# EAGLE design Accelerometer 3-Axis (EAGLE 6.1)
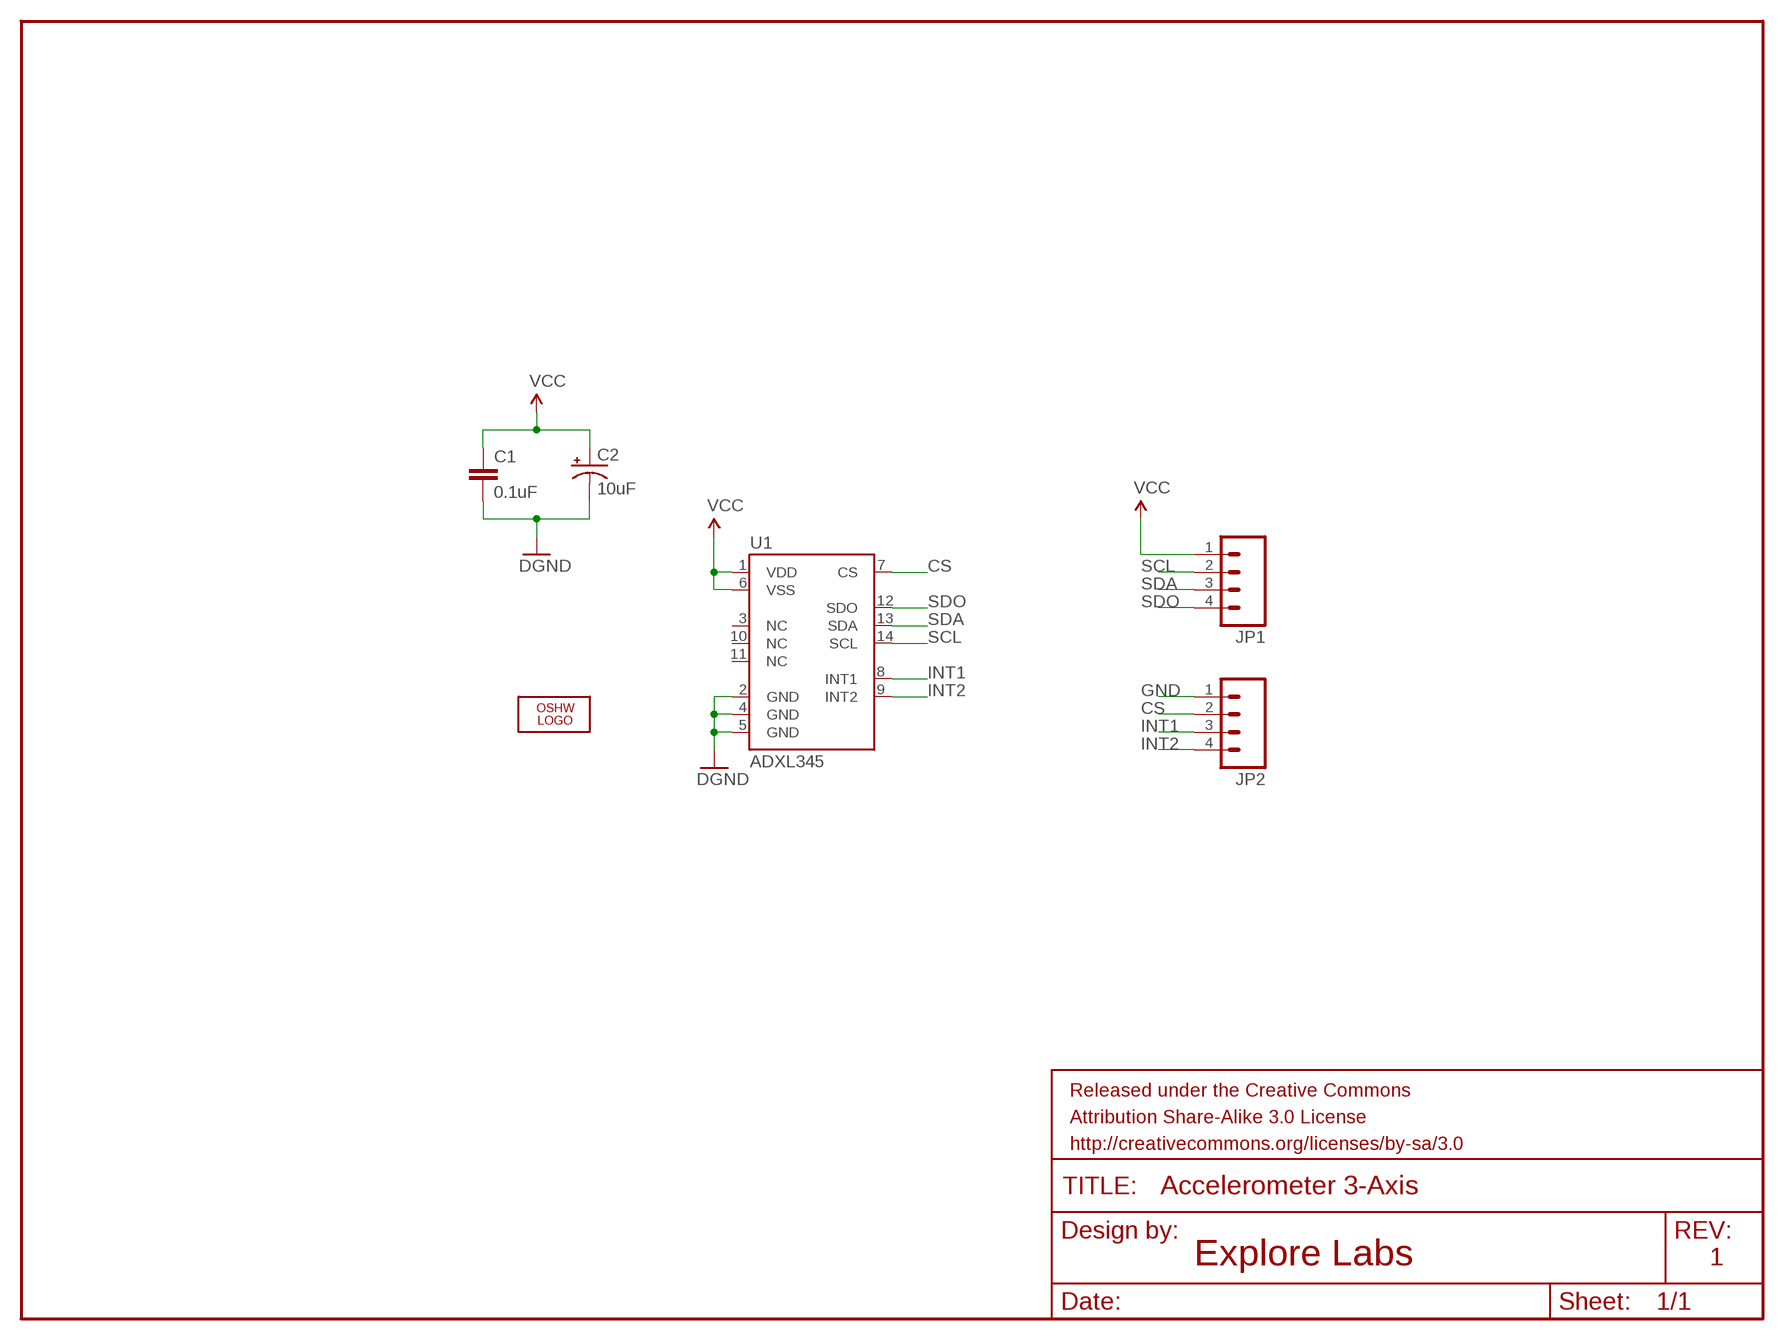
[diagram p0: schematic, sheet 1]

## Parts
C1  0.1uF  CAP0402-CAP  [0402-CAP]
C2  10uF  CAP_POL1206  [EIA3216]
JP1  M04PTH  [1X04]
JP2  M04PTH  [1X04]
LOGO2  OSHW_LOGO_FILLX0100-NT  [OSHW_FILLX100_NOTEXT]
U1  ADXL345  [LGA14]

## Nets
CS: JP2.2 U1.7(CS)
GND: C1.2 C2.C(-) JP2.1 U1.2(GND) U1.4(GND) U1.5(GND) ; supply symbol labelled DGND
INT1: JP2.3 U1.8(INT1)
INT2: JP2.4 U1.9(INT2)
SCL: JP1.2 U1.14(SCL)
SDA: JP1.3 U1.13(SDA)
SDO: JP1.4 U1.12(SDO)
VCC: C1.1 C2.A(+) JP1.1 U1.1(VDD) U1.6(VSS)
Unconnected: U1.3(NC) U1.10(NC) U1.11(NC)

## Notes on the sheet
- Explore Labs | 1

## Library data of the parts
C1 = SparkFun-Passives:CAP: Capacitor Standard 0603 ceramic capacitor, and 0.1" leaded capacitor.
C2 = SparkFun-Passives:CAP_POL: Capacitor Polarized These are standard SMD and PTH capacitors. Normally 10uF, 47uF, and 100uF in electrolytic and tantalum varieties. Always verify the external diameter of the through hole cap, it varies with capacity, voltage, and manufacturer. The EIA devices should be standard.
JP1 JP2 = SparkFun-Connectors:M04: Header 4 Standard 4-pin 0.1" header. Use with straight break away headers (SKU : PRT-00116), right angle break away headers (PRT-00553), swiss pins (PRT-00743), machine pins (PRT-00117), and female headers (PRT-00115). Molex polarized connector foot print use with SKU : PRT-08231 with associated crimp pins and housings. 1MM SMD Version SKU: PRT-10208
LOGO2 = ohw-logo:OSHW_LOGO_FILL
U1 = SparkFun-Sensors:ADXL345: 3-axis SPI/I2C 2/4/8/16g accelerometer

## Board
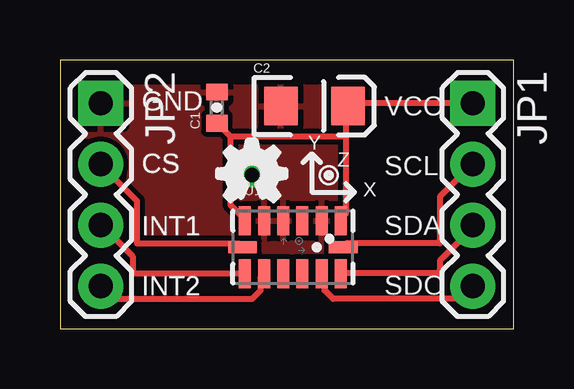
[diagram p1: board, top side]
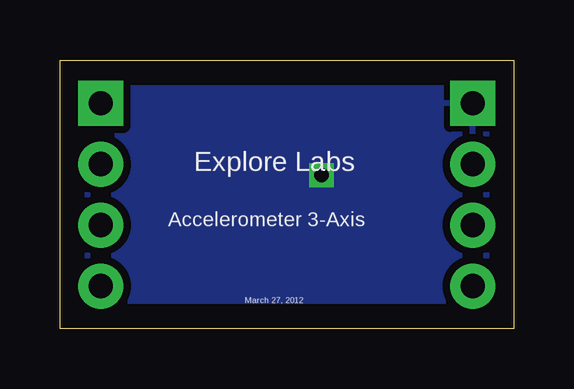
[diagram p2: board, bottom side, seen from below]

Size 18.9 x 11.2 mm. Coordinates in mm from the lower left corner, seen from the top.
Outline: 0,0 18.9,0 18.9,11.2 0,11.2 0,0
Copper layers (1*16): Top 0.035mm / dielectric 1.5mm / Bottom 0.035mm
Design rules: minimum track width 10mil, minimum drill 24mil, track to track 8mil, track to pad 8mil, pad to pad 8mil, via to via 8mil, smd to smd 8mil, copper to edge 40mil, drill to drill 8mil, minimum pad ring 10mil, minimum via ring 8mil, stop-mask expansion 4mil, vias tented up to drill 0mil, thermal gap 10mil

### Footprints (pad centres in the part's own frame; a part is rotated, then mirrored left to right if it is on the bottom)
0402-CAP = smd 0.7 x 0.9: 1 -0.65,0; 2 0.65,0
EIA3216 = smd 1.4 x 1.6: A 1.4,0; C -1.4,0
1X04 = drill 1.016 pad 1.88 square: 1 0,0 | drill 1.016 pad 1.88: 2 2.54,0; 3 5.08,0; 4 7.62,0
LGA14 = smd 0.5 x 1.2: 1 2,1.1; 2 1.2,1.1; 3 0.4,1.1; 4 -0.4,1.1; 5 -1.2,1.1; 6 -2,1.1; 8 -2,-1.1; 9 -1.2,-1.1; 10 -0.4,-1.1; 11 0.4,-1.1; 12 1.2,-1.1; 13 2,-1.1 | smd 1.2 x 0.5: 7 -2.1,0; 14 2.1,0

### Placement (x,y rotation side)
C1  6.54,9.21 90 top
C2  10.6,9.28 0 top
JP1  17.2,9.4 270 top
JP2  1.7,9.4 270 top
LOGO2  6.58,5.33 0 top
U1  9.7,3.4 0 top

### Tracks (layer width: path | path; a pad name or v marks a point on that pad's centre or on a via)
CS
  Top 0.254: U1.7 7.47,3.56 3.2,3.56 3.2,5.33 1.78,6.76 JP2.2
GND  (via drill 0.6)
  other vias: 8,6.4
  pour Bottom (isolate 0.305): 0,11.2 0,0 18.85,0 18.85,11.2
  pour Top: 18.85,0 0,0 0,11.2 18.85,11.2
INT1
  Top 0.254: U1.8 7.64,2.31 3.02,2.31 3.02,3.02 1.78,4.27 JP2.3
INT2
  Top 0.254: U1.9 8.36,2.13 8.36,1.6 8,1.25 1.78,1.25 1.78,1.78 JP2.4
SCL
  Top 0.254: U1.14 11.91,3.56 15.82,3.56 15.82,5.51 17.07,6.76 JP1.2
SDA
  Top 0.254: U1.13 11.73,2.31 15.82,2.31 15.82,2.85 17.07,4.09 17.07,4.27 JP1.3
SDO
  Top 0.254: U1.12 11.02,2.13 11.02,1.6 11.38,1.25 17.07,1.25 17.07,1.78 JP1.4
VCC
  Top 0.254: 7.11,8 6.58,8.53 C1.1 | 7.11,8 7.11,5.16 7.64,4.62 U1.6 | 11.91,8 11.91,9.25 C2.A 12.09,9.42 17.07,9.42 JP1.1 | 11.91,8 11.91,4.8 11.73,4.62 U1.1 | 11.91,8 7.11,8

### Text on the board
tNames: GND | CS | INT1 | INT2
_tsilk: GND | VCC | CS | Y | Z | X | SCL | INT1 | SDA | INT2 | SDO
_bsilk: Explore Labs | Accelerometer 3-Axis | March 27, 2012